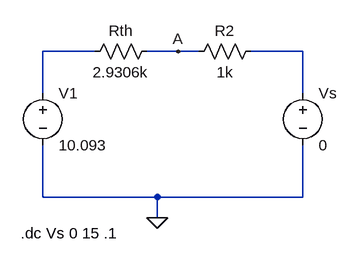
[diagram p0: schematic Task-2(Thevenin’s)_22101008.asc.asc]
Task-2(Thevenin’s)_22101008.asc.asc, the LTspice schematic file:
Version 4
SHEET 1 880 680
WIRE 16 48 -64 48
WIRE 144 48 96 48
WIRE 176 48 144 48
WIRE 336 48 256 48
WIRE -64 112 -64 48
WIRE 336 112 336 48
WIRE -64 272 -64 192
WIRE 112 272 -64 272
WIRE 336 272 336 192
WIRE 336 272 112 272
WIRE 112 304 112 272
FLAG 144 48 A
FLAG 112 304 0
SYMBOL voltage -64 96 R0
SYMATTR InstName V1
SYMATTR Value 10.093
SYMBOL voltage 336 96 R0
SYMATTR InstName Vs
SYMATTR Value 0
SYMBOL res 112 32 R90
WINDOW 0 0 56 VBottom 2
WINDOW 3 32 56 VTop 2
SYMATTR InstName Rth
SYMATTR Value 2.9306k
SYMBOL res 272 32 R90
WINDOW 0 0 56 VBottom 2
WINDOW 3 32 56 VTop 2
SYMATTR InstName R2
SYMATTR Value 1k
TEXT -98 328 Left 2 !.dc Vs 0 15 .1

The netlist it stands for:
* Task-2(Thevenin’s)_22101008.asc.asc
V1 N001 0 10.093
Vs N002 0 0
Rth A N001 2.9306k
R2 N002 A 1k
.dc Vs 0 15 .1
.backanno
.end